# Altium schematic sheet [04]STORAGE.SchDoc
size B
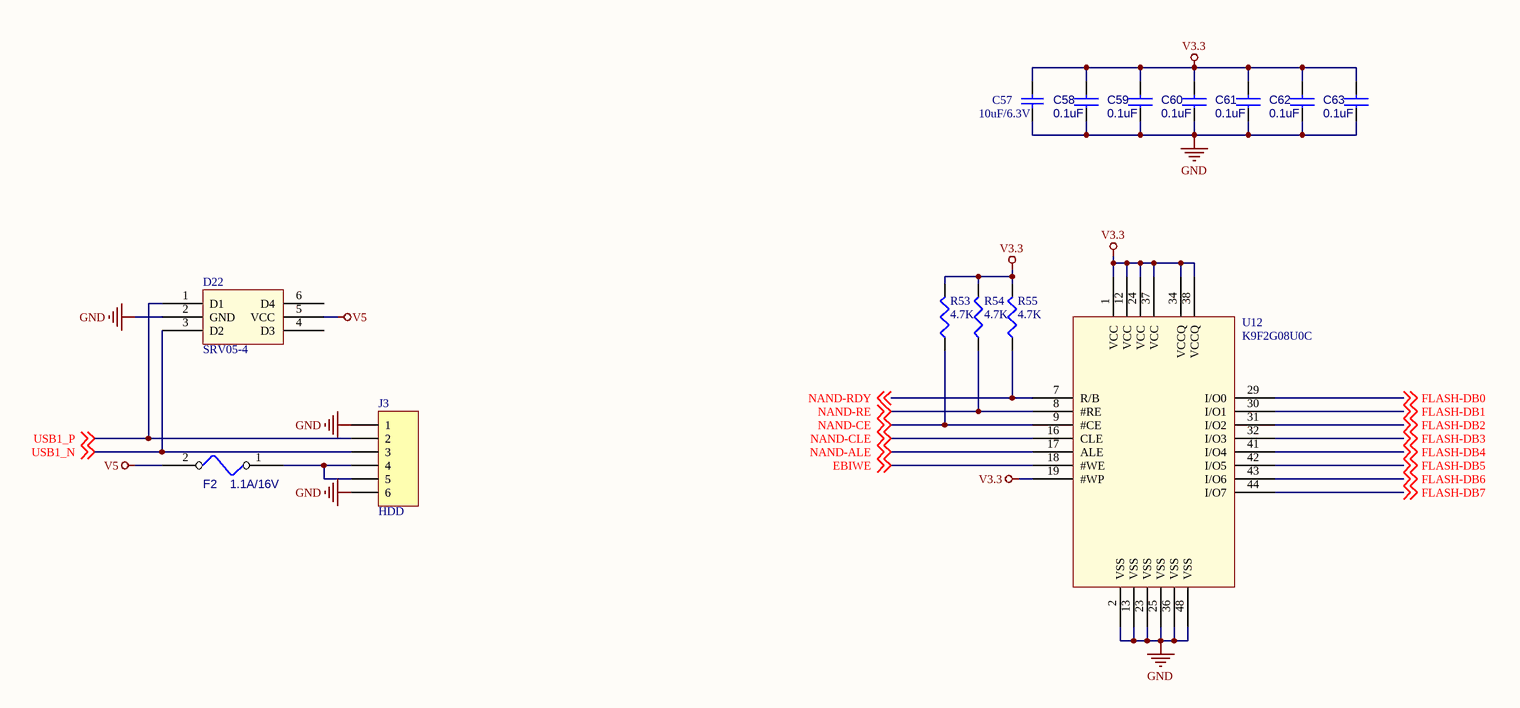
[diagram p0: [04]STORAGE.SchDoc]

## Parts
C57  10uF/6.3V  [0805]
C58  0.1uF  [0603]
C59  0.1uF  [0603]
C60  0.1uF  [0603]
C61  0.1uF  [0603]
C62  0.1uF  [0603]
C63  0.1uF  [0603]
D22  SRV05-4  [SOT23-6]
F2  1.1A/16V  [1812]
J3  HDD  [HDD-CONN]
R53  4.7K  [0603]
R54  4.7K  [0603]
R55  4.7K  [0603]
U12  K9F2G08U0C  [TSOP48]

## Nets
GND: C57.1 C58.1 C59.1 C60.1 C61.1 C62.1 C63.1 D22.2(GND) J3.1 J3.6 U12.2(VSS) U12.13(VSS) U12.23(VSS) U12.25(VSS) U12.36(VSS) U12.48(VSS)
V3.3: C57.2 C58.2 C59.2 C60.2 C61.2 C62.2 C63.2 R53.2 R54.2 R55.2 U12.1(VCC) U12.12(VCC) U12.19(#WP) U12.24(VCC) U12.34(VCCQ) U12.37(VCC) U12.38(VCCQ)
V5: D22.5(VCC) F2.2
EBIWE: U12.18(#WE) ; off-sheet EBIWE
FLASH-DB0: U12.29(I/O0) ; off-sheet FLASH-DB0
FLASH-DB1: U12.30(I/O1) ; off-sheet FLASH-DB1
FLASH-DB2: U12.31(I/O2) ; off-sheet FLASH-DB2
FLASH-DB3: U12.32(I/O3) ; off-sheet FLASH-DB3
FLASH-DB4: U12.41(I/O4) ; off-sheet FLASH-DB4
FLASH-DB5: U12.42(I/O5) ; off-sheet FLASH-DB5
FLASH-DB6: U12.43(I/O6) ; off-sheet FLASH-DB6
FLASH-DB7: U12.44(I/O7) ; off-sheet FLASH-DB7
NAND-ALE: U12.17(ALE) ; off-sheet NAND-ALE
NAND-CE: R53.1 U12.9(#CE) ; off-sheet NAND-CE
NAND-CLE: U12.16(CLE) ; off-sheet NAND-CLE
NAND-RDY: R55.1 U12.7(R/B) ; off-sheet NAND-RDY
NAND-RE: R54.1 U12.8(#RE) ; off-sheet NAND-RE
USB1_N: D22.3(D2) J3.3 ; off-sheet USB1_N
USB1_P: D22.1(D1) J3.2 ; off-sheet USB1_P
NetF2_1: F2.1 J3.4 J3.5

Not connected (* = marked no-connect by the designer): D22 4(D3) 6(D4)

## Library data of the parts
C57 = Cap: Capacitor
C58-C63 = CAP NP_Dup2
F2 = 2A_32VDC_0467-002
J3 = Header 6: Header, 6-Pin; LatestRevisionDate: 17-Jul-2002; LatestRevisionNote: Re-released for DXP Platform.; Publisher: Altium Limited
R53-R55 = Res3: Resistor
U12 = K9GBG08U0A